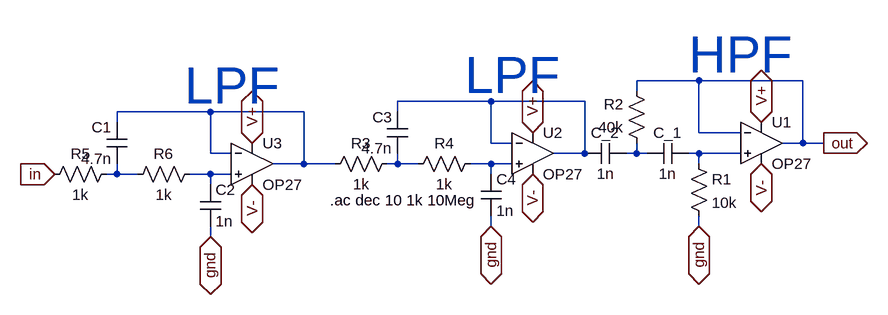
[diagram p0: schematic bandpass.asc]
bandpass.asc, the LTspice schematic file:
Version 4.1
SHEET 1 880 680
WIRE 448 48 352 48
WIRE 608 48 448 48
WIRE 352 64 352 48
WIRE 128 80 -16 80
WIRE 272 80 128 80
WIRE -304 96 -448 96
WIRE -160 96 -304 96
WIRE -16 96 -16 80
WIRE -448 112 -448 96
WIRE 448 128 448 48
WIRE 512 128 448 128
WIRE 128 144 128 80
WIRE 160 144 128 144
WIRE 608 144 608 48
WIRE 608 144 576 144
WIRE 640 144 608 144
WIRE -304 160 -304 96
WIRE -272 160 -304 160
WIRE 272 160 272 80
WIRE 272 160 224 160
WIRE 352 160 352 144
WIRE 352 160 336 160
WIRE 368 160 352 160
WIRE 448 160 432 160
WIRE 512 160 448 160
WIRE -160 176 -160 96
WIRE -160 176 -208 176
WIRE -112 176 -160 176
WIRE -16 176 -16 160
WIRE -16 176 -32 176
WIRE 16 176 -16 176
WIRE 128 176 96 176
WIRE 160 176 128 176
WIRE 448 176 448 160
WIRE -448 192 -448 176
WIRE -448 192 -464 192
WIRE -416 192 -448 192
WIRE -304 192 -336 192
WIRE -272 192 -304 192
WIRE 128 192 128 176
WIRE -304 208 -304 192
WIRE 128 272 128 256
WIRE 448 272 448 256
WIRE -304 288 -304 272
FLAG 640 144 out
IOPIN 640 144 Out
FLAG 448 272 gnd
IOPIN 448 272 BiDir
FLAG 128 272 gnd
IOPIN 128 272 BiDir
FLAG 544 112 V+
IOPIN 544 112 BiDir
FLAG 192 128 V+
IOPIN 192 128 BiDir
FLAG 544 176 V-
IOPIN 544 176 BiDir
FLAG 192 192 V-
IOPIN 192 192 BiDir
FLAG -304 288 gnd
IOPIN -304 288 BiDir
FLAG -240 144 V+
IOPIN -240 144 BiDir
FLAG -240 208 V-
IOPIN -240 208 BiDir
FLAG -544 192 in
IOPIN -544 192 In
SYMBOL OpAmps\\OP27 544 80 R0
SYMATTR InstName U1
SYMBOL res 432 160 R0
SYMATTR InstName R1
SYMATTR Value 10k
SYMBOL cap 368 176 R270
WINDOW 0 32 32 VTop 2
WINDOW 3 0 32 VBottom 2
SYMATTR InstName C_1
SYMATTR Value 1n
SYMBOL cap 272 176 R270
WINDOW 0 32 32 VTop 2
WINDOW 3 0 32 VBottom 2
SYMATTR InstName C_2
SYMATTR Value 1n
SYMBOL res 368 160 R180
WINDOW 0 36 76 Left 2
WINDOW 3 36 40 Left 2
SYMATTR InstName R2
SYMATTR Value 40k
SYMBOL res -128 192 R270
WINDOW 0 32 56 VTop 2
WINDOW 3 0 56 VBottom 2
SYMATTR InstName R3
SYMATTR Value 1k
SYMBOL cap 0 160 R180
WINDOW 0 24 56 Left 2
WINDOW 3 24 8 Left 2
SYMATTR InstName C3
SYMATTR Value 4.7n
SYMBOL res 0 192 R270
WINDOW 0 32 56 VTop 2
WINDOW 3 0 56 VBottom 2
SYMATTR InstName R4
SYMATTR Value 1k
SYMBOL cap 112 192 R0
SYMATTR InstName C4
SYMATTR Value 1n
SYMBOL OpAmps\\OP27 192 96 R0
SYMATTR InstName U2
SYMBOL res -560 208 R270
WINDOW 0 32 56 VTop 2
WINDOW 3 0 56 VBottom 2
SYMATTR InstName R5
SYMATTR Value 1k
SYMBOL cap -432 176 R180
WINDOW 0 24 56 Left 2
WINDOW 3 24 8 Left 2
SYMATTR InstName C1
SYMATTR Value 4.7n
SYMBOL res -432 208 R270
WINDOW 0 32 56 VTop 2
WINDOW 3 0 56 VBottom 2
SYMATTR InstName R6
SYMATTR Value 1k
SYMBOL cap -320 208 R0
SYMATTR InstName C2
SYMATTR Value 1n
SYMBOL OpAmps\\OP27 -240 112 R0
SYMATTR InstName U3
TEXT -344 56 Left 6 ;LPF
TEXT 432 8 Left 6 ;HPF
TEXT -120 232 Left 2 !.ac dec 10 1k 10Meg
TEXT 88 40 Left 6 ;LPF

The netlist it stands for:
* bandpass.asc
X§U1 N004 out V+ V- out OP27  ; pins In+ In- V+ V- OUT
R1 N004 gnd 10k
C_1 N003 N004 1n
C_2 N001 N003 1n
R2 N003 out 40k
R3 N002 N005 1k
C3 N005 N001 4.7n
R4 N005 N006 1k
C4 N006 gnd 1n
X§U2 N006 N001 V+ V- N001 OP27  ; pins In+ In- V+ V- OUT
R5 in N007 1k
C1 N007 N002 4.7n
R6 N007 N008 1k
C2 N008 gnd 1n
X§U3 N008 N002 V+ V- N002 OP27  ; pins In+ In- V+ V- OUT
* LPF
* HPF
.ac dec 10 1k 10Meg
* LPF
.lib ADI.lib
.backanno
.end